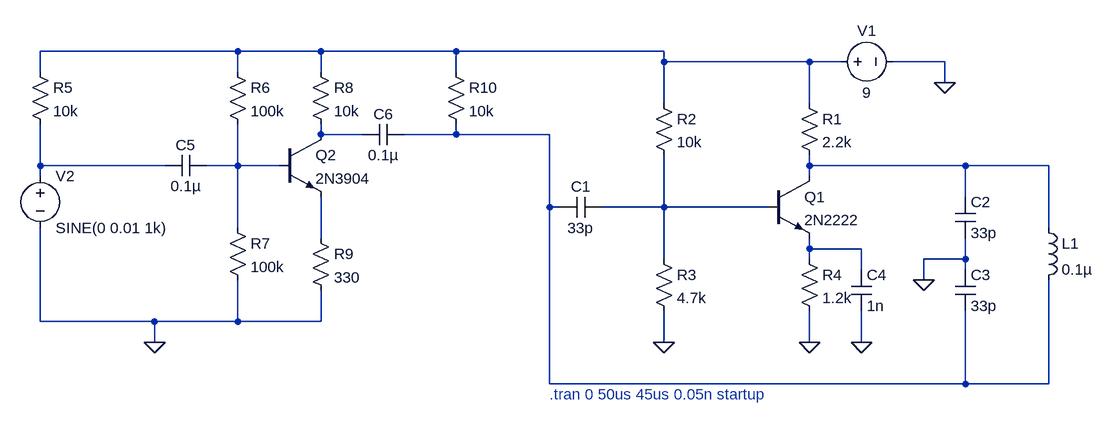
[diagram p0: schematic FM TRANSMITTER.asc]
FM TRANSMITTER.asc, the LTspice schematic file:
Version 4.1
SHEET 1 1292 680
WIRE -32 -32 -336 -32
WIRE 96 -32 -32 -32
WIRE 304 -32 96 -32
WIRE 624 -32 304 -32
WIRE 624 -16 624 -32
WIRE 848 -16 624 -16
WIRE 896 -16 848 -16
WIRE 1056 -16 976 -16
WIRE -336 0 -336 -32
WIRE -32 0 -32 -32
WIRE 96 0 96 -32
WIRE 304 0 304 -32
WIRE 1056 16 1056 -16
WIRE 624 48 624 -16
WIRE 848 48 848 -16
WIRE 96 96 96 80
WIRE 160 96 96 96
WIRE 304 96 304 80
WIRE 304 96 224 96
WIRE 448 96 304 96
WIRE -336 144 -336 80
WIRE -144 144 -336 144
WIRE -32 144 -32 80
WIRE -32 144 -80 144
WIRE 32 144 -32 144
WIRE 848 144 848 128
WIRE 1088 144 848 144
WIRE 1216 144 1088 144
WIRE -336 160 -336 144
WIRE 848 160 848 144
WIRE 1088 192 1088 144
WIRE 448 208 448 96
WIRE 464 208 448 208
WIRE 624 208 624 128
WIRE 624 208 528 208
WIRE 784 208 624 208
WIRE -32 240 -32 144
WIRE 1216 240 1216 144
WIRE 96 256 96 192
WIRE 848 272 848 256
WIRE 928 272 848 272
WIRE 624 288 624 208
WIRE 848 288 848 272
WIRE 1088 288 1088 256
WIRE 1088 288 1024 288
WIRE 928 304 928 272
WIRE 1088 304 1088 288
WIRE 1024 320 1024 288
WIRE -336 384 -336 240
WIRE -160 384 -336 384
WIRE -32 384 -32 320
WIRE -32 384 -160 384
WIRE 96 384 96 336
WIRE 96 384 -32 384
WIRE -160 416 -160 384
WIRE 624 416 624 368
WIRE 848 416 848 368
WIRE 928 416 928 368
WIRE 448 480 448 208
WIRE 1088 480 1088 368
WIRE 1088 480 448 480
WIRE 1216 480 1216 320
WIRE 1216 480 1088 480
FLAG 1056 16 0
FLAG 624 416 0
FLAG 1024 320 0
FLAG 848 416 0
FLAG 928 416 0
FLAG -160 416 0
SYMBOL voltage 880 -16 R270
WINDOW 0 32 56 VTop 2
WINDOW 3 -32 56 VBottom 2
WINDOW 123 0 0 Left 0
WINDOW 39 0 0 Left 0
SYMATTR InstName V1
SYMATTR Value 9
SYMBOL res 832 32 R0
SYMATTR InstName R1
SYMATTR Value 2.2k
SYMBOL res 608 32 R0
SYMATTR InstName R2
SYMATTR Value 10k
SYMBOL res 608 272 R0
SYMATTR InstName R3
SYMATTR Value 4.7k
SYMBOL res 832 272 R0
SYMATTR InstName R4
SYMATTR Value 1.2k
SYMBOL npn 784 160 R0
SYMATTR InstName Q1
SYMATTR Value 2N2222
SYMBOL cap 528 192 R90
WINDOW 0 0 32 VBottom 2
WINDOW 3 32 32 VTop 2
SYMATTR InstName C1
SYMATTR Value 33p
SYMBOL cap 1072 192 R0
SYMATTR InstName C2
SYMATTR Value 33p
SYMBOL cap 1072 304 R0
SYMATTR InstName C3
SYMATTR Value 33p
SYMBOL ind 1200 224 R0
SYMATTR InstName L1
SYMATTR Value 0.1µ
SYMATTR SpiceLine Rser=1m
SYMBOL cap 912 304 R0
SYMATTR InstName C4
SYMATTR Value 1n
SYMBOL voltage -336 144 R0
WINDOW 123 0 0 Left 0
WINDOW 39 0 0 Left 0
SYMATTR InstName V2
SYMATTR Value SINE(0 0.01 1k)
SYMBOL npn 32 96 R0
SYMATTR InstName Q2
SYMATTR Value 2N3904
SYMBOL cap -80 128 R90
WINDOW 0 0 32 VBottom 2
WINDOW 3 32 32 VTop 2
SYMATTR InstName C5
SYMATTR Value 0.1µ
SYMBOL res -352 -16 R0
SYMATTR InstName R5
SYMATTR Value 10k
SYMBOL res -48 -16 R0
SYMATTR InstName R6
SYMATTR Value 100k
SYMBOL res -48 224 R0
SYMATTR InstName R7
SYMATTR Value 100k
SYMBOL res 80 -16 R0
SYMATTR InstName R8
SYMATTR Value 10k
SYMBOL res 80 240 R0
SYMATTR InstName R9
SYMATTR Value 330
SYMBOL res 288 -16 R0
SYMATTR InstName R10
SYMATTR Value 10k
SYMBOL cap 224 80 R90
WINDOW 0 0 32 VBottom 2
WINDOW 3 32 32 VTop 2
SYMATTR InstName C6
SYMATTR Value 0.1µ
TEXT 448 496 Left 2 ;.tran 0 50us 45us 0.05n startup

The netlist it stands for:
* FM TRANSMITTER.asc
V1 N001 0 9
R1 N001 N006 2.2k
R2 N001 N007 10k
R3 N007 0 4.7k
R4 N009 0 1.2k
Q1 N006 N007 N009 0 2N2222
C1 N007 N003 33p
C2 N006 0 33p
C3 0 N003 33p
L1 N006 N003 0.1µ Rser=1m
C4 N009 0 1n
V2 N004 0 SINE(0 0.01 1k)
Q2 N002 N005 N008 0 2N3904
C5 N005 N004 0.1µ
R5 N001 N004 10k
R6 N001 N005 100k
R7 N005 0 100k
R8 N001 N002 10k
R9 N008 0 330
R10 N001 N003 10k
C6 N003 N002 0.1µ
.model NPN NPN
.model PNP PNP
.lib standard.bjt
* .tran 0 50us 45us 0.05n startup
.backanno
.end